# Altium schematic sheet Power_output.SchDoc
size A4; DocumentNumber: 1; SheetNumber: 1; SheetTotal: 1
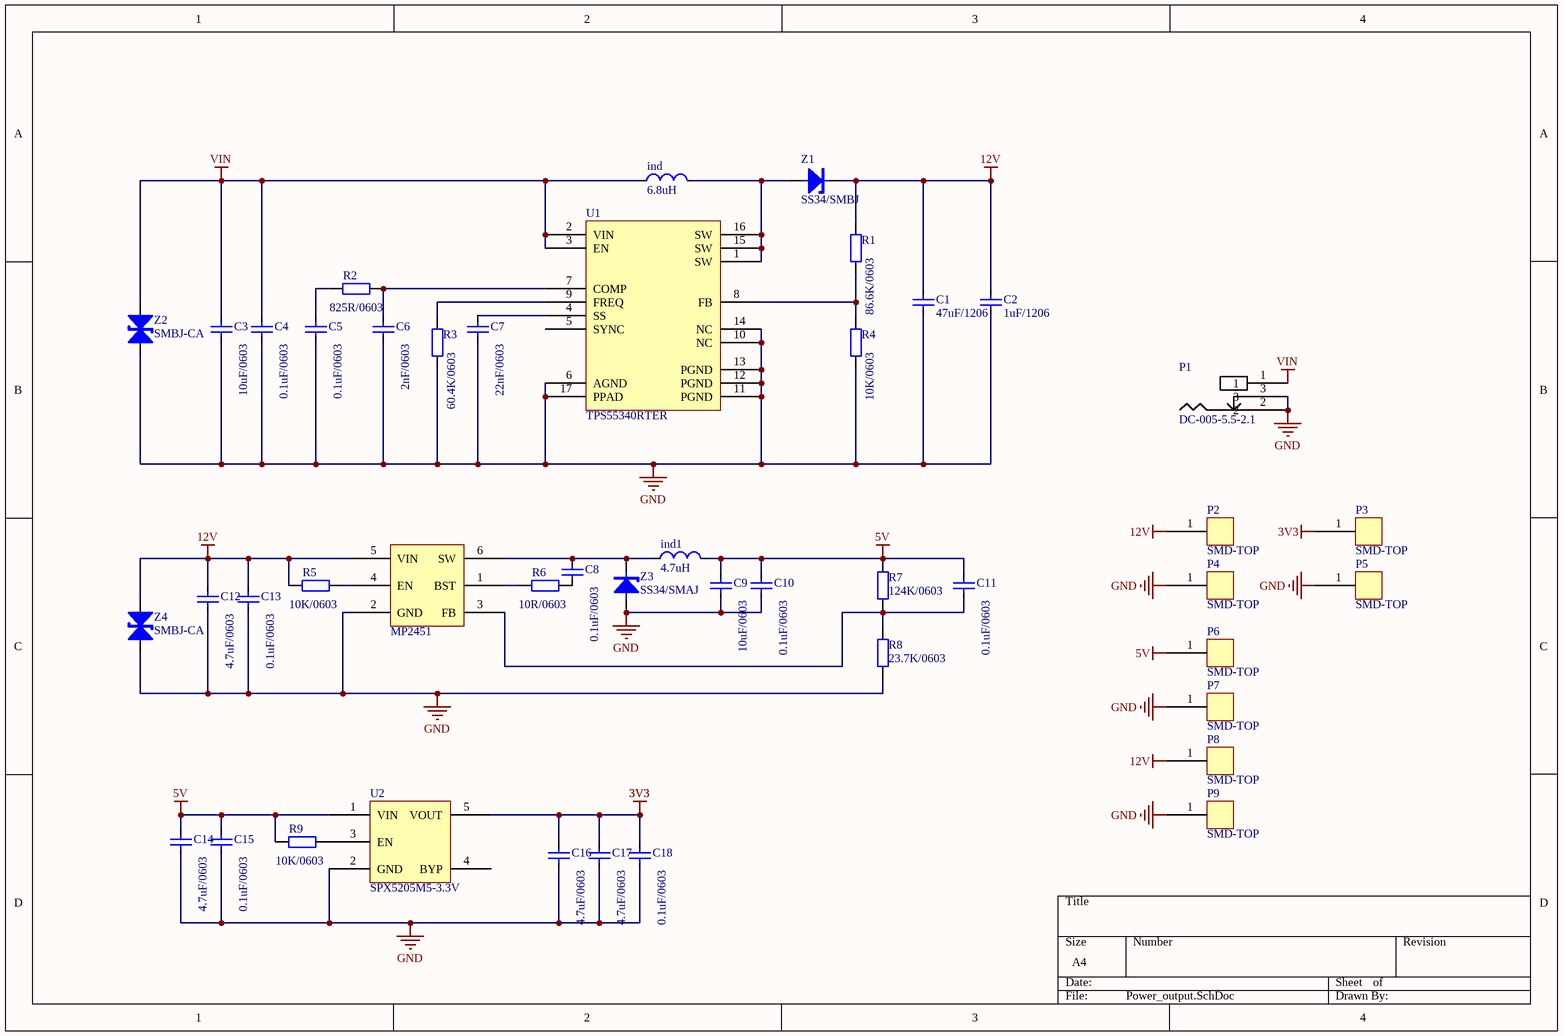
[diagram p0: Power_output.SchDoc]

## Parts
C1  value 47uF/1206  [CAP_1206]  (hidden comment: ?uF)
C2  value 1uF/1206  [CAP_1206]  (hidden comment: ?uF)
C3  value 10uF/0603  [CAP_0603]  (hidden comment: ?uF)
C4  value 0.1uF/0603  [CAP_0603]  (hidden comment: ?uF)
C5  value 0.1uF/0603  [CAP_0603]  (hidden comment: ?uF)
C6  value 2nF/0603  [CAP_0603]  (hidden comment: ?uF)
C7  value 22nF/0603  [CAP_0603]  (hidden comment: ?uF)
C8  value 0.1uF/0603  [CAP_0603]  (hidden comment: ?uF)
C9  value 10uF/0603  [CAP_0603]  (hidden comment: ?uF)
C10  value 0.1uF/0603  [CAP_0603]  (hidden comment: ?uF)
C11  value 0.1uF/0603  [CAP_0603]  (hidden comment: ?uF)
C12  value 4.7uF/0603  [CAP_0603]  (hidden comment: ?uF)
C13  value 0.1uF/0603  [CAP_0603]  (hidden comment: ?uF)
C14  value 4.7uF/0603  [CAP_0603]  (hidden comment: ?uF)
C15  value 0.1uF/0603  [CAP_0603]  (hidden comment: ?uF)
C16  value 4.7uF/0603  [CAP_0603]  (hidden comment: ?uF)
C17  value 4.7uF/0603  [CAP_0603]  (hidden comment: ?uF)
C18  value 0.1uF/0603  [CAP_0603]  (hidden comment: ?uF)
ind  6.8uH  [IND4*4*2]
ind1  4.7uH  [IND4*4*2]
MP2451  MP2451  [SOT23-6]  (value not drawn)
P1  DC-005-5.5-2.1  [DC-005]
P2  SMD-TOP  [SMD-TOP]
P3  SMD-TOP  [SMD-TOP]
P4  SMD-TOP  [SMD-TOP]
P5  SMD-TOP  [SMD-TOP]
P6  SMD-TOP  [SMD-TOP]
P7  SMD-TOP  [SMD-TOP]
P8  SMD-TOP  [SMD-TOP]
P9  SMD-TOP  [SMD-TOP]
R1  value 86.6K/0603  [RES_0603]  (hidden comment: ?K)
R2  value 825R/0603  [RES_0603]  (hidden comment: ?K)
R3  value 60.4K/0603  [RES_0603]  (hidden comment: ?K)
R4  value 10K/0603  [RES_0603]  (hidden comment: ?K)
R5  value 10K/0603  [RES_0603]  (hidden comment: ?K)
R6  value 10R/0603  [RES_0603]  (hidden comment: ?K)
R7  value 124K/0603  [RES_0603]  (hidden comment: ?K)
R8  value 23.7K/0603  [RES_0603]  (hidden comment: ?K)
R9  value 10K/0603  [RES_0603]  (hidden comment: ?K)
U1  TPS55340RTER  [WQFN16]
U2  SPX5205M5-3.3V  [SOT23-5]
Z1  SS34/SMBJ  [SMB]
Z2  SMBJ-CA  [SMB( No proporcionado)]
Z3  SS34/SMAJ  [SMA]
Z4  SMBJ-CA  [SMB( No proporcionado)]

## Nets
3V3: C16.2 C17.2 C18.2 P3.1 U2.5(VOUT)
5V: C9.2 C10.2 C11.2 C14.2 C15.2 ind1.2 P6.1 R7.2 R9.1 U2.1(VIN)
12V: C1.2 C2.2 C12.2 C13.2 MP2451.5(VIN) P2.1 P8.1 R1.2 R5.1 Z1.2(C) Z4.2(C)
GND: C1.1 C2.1 C3.1 C4.1 C5.1 C6.1 C7.1 C9.1 C10.1 C12.1 C13.1 C14.1 C15.1 C16.1 C17.1 C18.1 MP2451.2(GND) P1.2 P1.3 P4.1 P5.1 P7.1 P9.1 R3.1 R4.1 R8.1 U1.6(AGND) U1.10(NC) U1.11(PGND) U1.12(PGND) U1.13(PGND) U1.14(NC) U1.17(PPAD) U2.2(GND) Z2.1(A) Z3.1(A) Z4.1(A)
VIN: C3.2 C4.2 ind.1 P1.1 U1.2(VIN) U1.3(EN) Z2.2(C)
NetC5_2: C5.2 R2.1
NetC6_2: C6.2 R2.2 U1.7(COMP)
NetC7_2: C7.2 U1.4(SS)
NetC8_1: C8.1 R6.2
NetC8_2: C8.2 ind1.1 MP2451.6(SW) Z3.2(C)
NetC11_1: C11.1 MP2451.3(FB) R7.1 R8.2
Netind_2: ind.2 U1.1(SW) U1.15(SW) U1.16(SW) Z1.1(A)
NetMP2451_1: MP2451.1(BST) R6.1
NetMP2451_4: MP2451.4(EN) R5.2
NetR1_1: R1.1 R4.2 U1.8(FB)
NetR3_2: R3.2 U1.9(FREQ)
NetR9_2: R9.2 U2.3(EN)

Not connected (* = marked no-connect by the designer): U1 5(SYNC); U2 4(BYP)

## Library data of the parts
C1 C2 = Cap_1206: Capacitor
C3-C18 = Cap_0603: Capacitor
ind ind1 = Ind
MP2451 = MP2451: 降压转换器
R1-R9 = Res_0603: Resistor
U2 = SPX5205M5-3.3V: LDO IC
Z1 = SMBJ: TVS; SMB: SS?
Z2 Z4 = SMBJ-CA: TVS
Z3 = SMAJ: TVS; SMA: D?